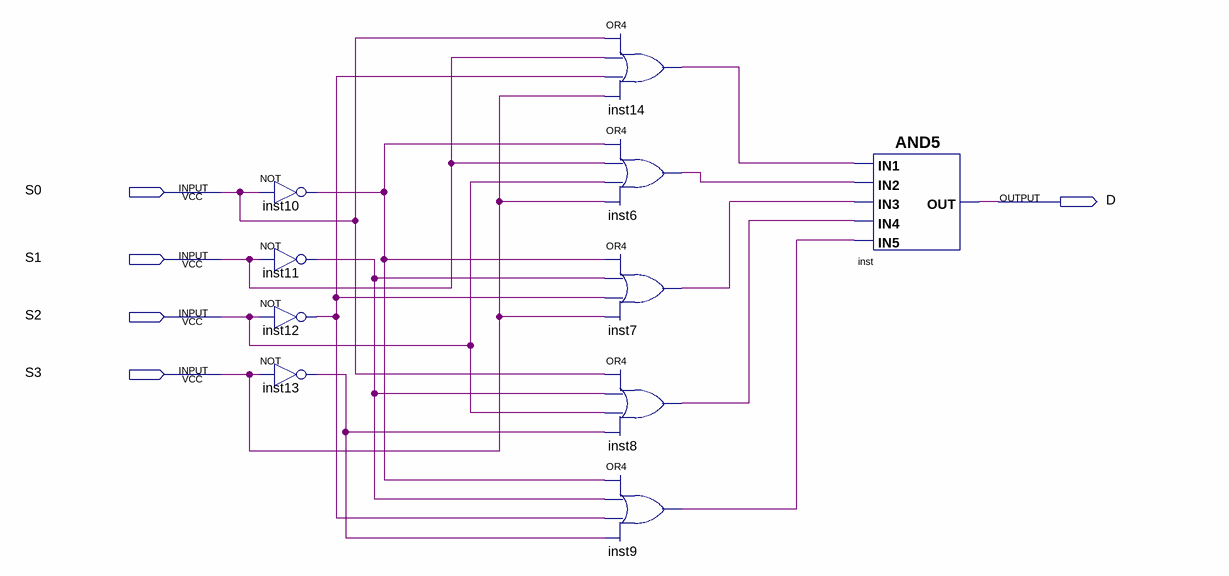
[diagram p0: schematic sheet]
// Quartus schematic D-nda2_3.bdf as structural Verilog: 10 symbols, 5 pins
module \D-nda2_3  (
  input  S0,
  input  S1,
  input  S2,
  input  S3,
  output D
);

  wire inst6_out, inst7_out, inst8_out, inst9_out, inst10_out, inst11_out, inst12_out, inst13_out, inst14_out;

  not inst10 (inst10_out, S0);
  not inst11 (inst11_out, S1);
  not inst12 (inst12_out, S2);
  not inst13 (inst13_out, S3);
  or inst14 (inst14_out, S0, S1, inst12_out, S3);
  or inst6 (inst6_out, inst10_out, S1, S2, S3);
  or inst7 (inst7_out, inst10_out, inst11_out, inst12_out, S3);
  or inst8 (inst8_out, S0, inst11_out, S2, inst13_out);
  or inst9 (inst9_out, inst10_out, inst11_out, inst12_out, inst13_out);
  and inst (D, inst14_out, inst6_out, inst7_out, inst8_out, inst9_out);
endmodule
